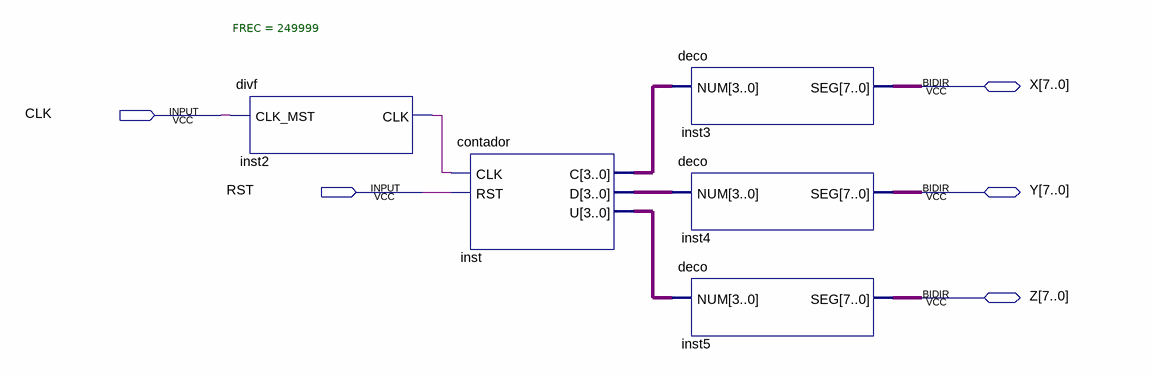
[diagram p0: schematic sheet]
// Quartus schematic practica04.bdf as structural Verilog: 5 symbols, 5 pins
module practica04 (
  input  CLK,
  input  RST,
  inout  [7:0] X,
  inout  [7:0] Y,
  inout  [7:0] Z
);

  wire inst2_clk;
  wire [3:0] inst_c, inst_d, inst_u;

  divf #(.FREC(249999)) inst2 (.CLK_MST(CLK), .CLK(inst2_clk));
  contador inst (.CLK(inst2_clk), .RST(RST), .C(inst_c), .D(inst_d), .U(inst_u));
  deco inst3 (.NUM(inst_c), .SEG(X));
  deco inst4 (.NUM(inst_d), .SEG(Y));
  deco inst5 (.NUM(inst_u), .SEG(Z));
endmodule
